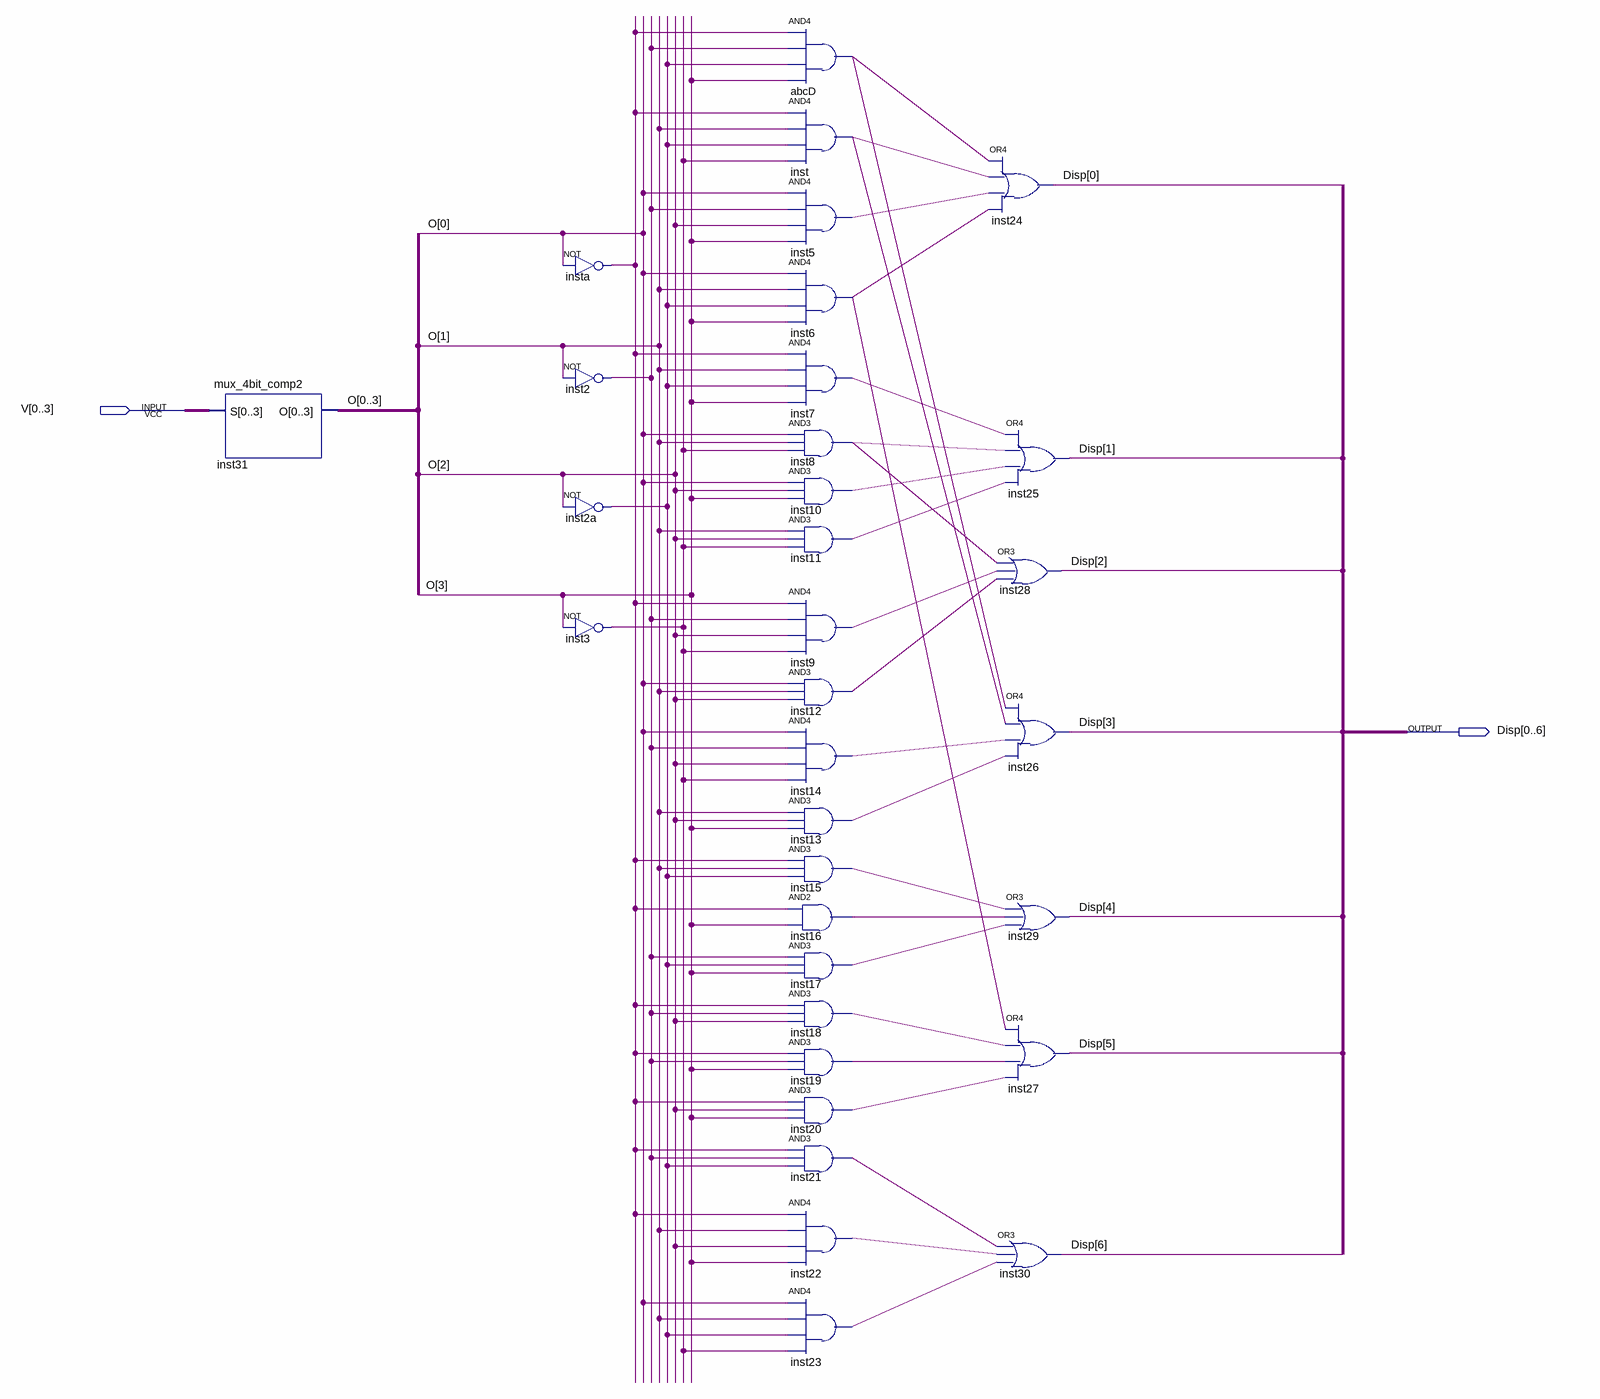
[diagram p0: schematic sheet]
// Quartus schematic Seven_Segment_Display_comp2.bdf as structural Verilog: 33 symbols, 2 pins
module Seven_Segment_Display_comp2 (
  input  [0:3] V,
  output [0:6] Disp
);

  wire abcD_out, inst2_out, inst2a_out, inst3_out, inst5_out, inst6_out, inst7_out, inst8_out, inst9_out,
       inst10_out, inst11_out, inst12_out, inst13_out, inst14_out, inst15_out, inst16_out, inst17_out,
       inst18_out, inst19_out, inst20_out, inst21_out, inst22_out, inst23_out, inst_out, insta_out;
  wire [3:0] O;

  mux_4bit_comp2 inst31 (.S(V), .O({O[0], O[1], O[2], O[3]}));
  not insta (insta_out, O[0]);
  not inst2 (inst2_out, O[1]);
  not inst2a (inst2a_out, O[2]);
  not inst3 (inst3_out, O[3]);
  and abcD (abcD_out, insta_out, inst2_out, inst2a_out, O[3]);
  and inst (inst_out, insta_out, O[1], inst2a_out, inst3_out);
  and inst5 (inst5_out, O[0], inst2_out, O[2], O[3]);
  and inst6 (inst6_out, O[0], O[1], inst2a_out, O[3]);
  and inst7 (inst7_out, insta_out, O[1], inst2a_out, O[3]);
  and inst8 (inst8_out, O[0], O[1], inst3_out);
  and inst10 (inst10_out, O[0], O[2], O[3]);
  and inst11 (inst11_out, O[1], O[2], inst3_out);
  and inst9 (inst9_out, insta_out, inst2_out, O[2], inst3_out);
  and inst12 (inst12_out, O[0], O[1], O[2]);
  and inst14 (inst14_out, O[0], inst2_out, O[2], inst3_out);
  and inst13 (inst13_out, O[1], O[2], O[3]);
  and inst15 (inst15_out, insta_out, O[1], inst2a_out);
  and inst16 (inst16_out, insta_out, O[3]);
  and inst17 (inst17_out, inst2_out, inst2a_out, O[3]);
  and inst18 (inst18_out, insta_out, inst2_out, O[2]);
  and inst19 (inst19_out, insta_out, inst2_out, O[3]);
  and inst20 (inst20_out, insta_out, O[2], O[3]);
  and inst21 (inst21_out, insta_out, inst2_out, inst2a_out);
  and inst22 (inst22_out, insta_out, O[1], O[2], O[3]);
  and inst23 (inst23_out, O[0], O[1], inst2a_out, inst3_out);
  or inst24 (Disp[0], abcD_out, inst_out, inst5_out, inst6_out);
  or inst25 (Disp[1], inst7_out, inst8_out, inst10_out, inst11_out);
  or inst28 (Disp[2], inst8_out, inst9_out, inst12_out);
  or inst26 (Disp[3], abcD_out, inst_out, inst14_out, inst13_out);
  or inst29 (Disp[4], inst15_out, inst16_out, inst17_out);
  or inst27 (Disp[5], inst6_out, inst18_out, inst19_out, inst20_out);
  or inst30 (Disp[6], inst21_out, inst22_out, inst23_out);
endmodule
